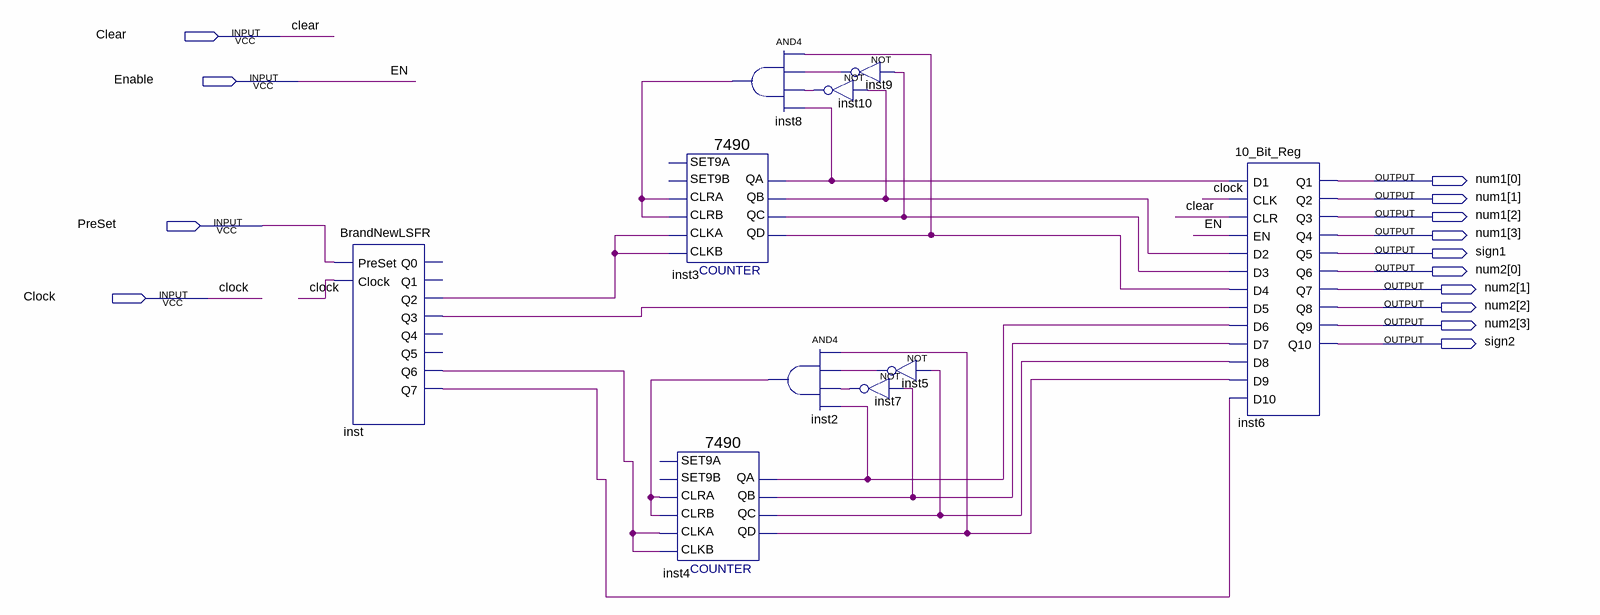
[diagram p0: schematic sheet]
// Quartus schematic BRAND_New_RNG.bdf as structural Verilog: 10 symbols, 14 pins
module BRAND_New_RNG (
  input  Clear,
  input  Enable,
  input  PreSet,
  input  Clock,
  output [3:0] num1,
  output sign1,
  output [3:0] num2,
  output sign2
);

  wire inst2_out, inst3_qa, inst3_qb, inst3_qc, inst3_qd, inst4_qa, inst4_qb, inst4_qc, inst4_qd, inst5_out,
       inst7_out, inst8_out, inst9_out, inst10_out, inst_q2, inst_q3, inst_q6, inst_q7;

  BrandNewLSFR inst (
    .PreSet(PreSet), .Clock(Clock), .Q2(inst_q2), .Q3(inst_q3), .Q6(inst_q6), .Q7(inst_q7));  // open: Q0, Q1, Q4, Q5
  \7490  inst3 (
    .CLRA(inst8_out), .CLKB(inst_q2), .CLKA(inst_q2), .CLRB(inst8_out), .QD(inst3_qd), .QA(inst3_qa),
    .QB(inst3_qb), .QC(inst3_qc));  // open: SET9A, SET9B
  \7490  inst4 (
    .CLRA(inst2_out), .CLKB(inst_q6), .CLKA(inst_q6), .CLRB(inst2_out), .QD(inst4_qd), .QA(inst4_qa),
    .QB(inst4_qb), .QC(inst4_qc));  // open: SET9A, SET9B
  and inst8 (inst8_out, inst3_qd, inst9_out, inst10_out, inst3_qa);
  not inst10 (inst10_out, inst3_qb);
  and inst2 (inst2_out, inst4_qd, inst5_out, inst7_out, inst4_qa);
  not inst9 (inst9_out, inst3_qc);
  not inst5 (inst5_out, inst4_qc);
  not inst7 (inst7_out, inst4_qb);
  \10_Bit_Reg  inst6 (
    .D1(inst3_qa), .CLK(Clock), .CLR(Clear), .EN(Enable), .D2(inst3_qb), .D3(inst3_qc), .D4(inst3_qd),
    .D5(inst_q3), .D6(inst4_qa), .D7(inst4_qb), .D8(inst4_qc), .D9(inst4_qd), .D10(inst_q7), .Q1(num1[0]),
    .Q2(num1[1]), .Q3(num1[2]), .Q4(num1[3]), .Q5(sign1), .Q6(num2[0]), .Q7(num2[1]), .Q8(num2[2]),
    .Q9(num2[3]), .Q10(sign2));

  // Other names for the same wires on the sheet: EN = Enable
endmodule
